# Altium schematic sheet DAPLink.SchDoc
size A4
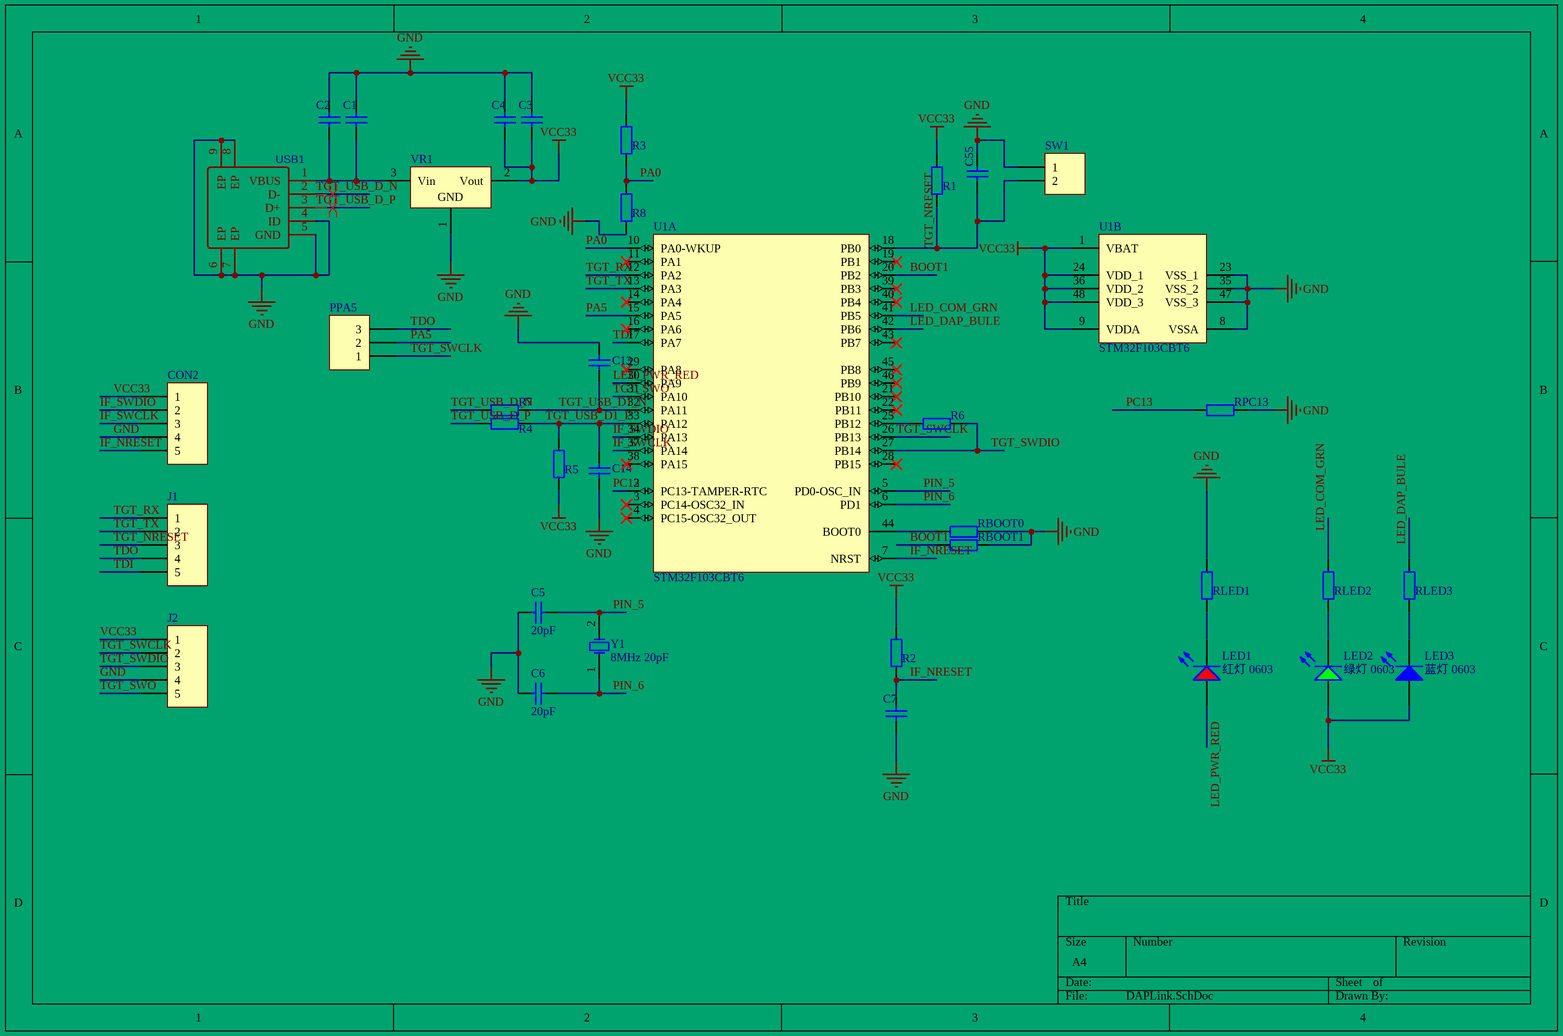
[diagram p0: DAPLink.SchDoc]

## Parts
C1  10uF (475) 10% 50V  [1206_C]  (value not drawn)
C2  100nF (475) 10% 50V  [1206_C]  (value not drawn)
C3  10uF (475) 10% 50V  [1206_C]  (value not drawn)
C4  100nF (475) 10% 50V  [1206_C]  (value not drawn)
C5  20pF  [1206_C]
C6  20pF  [1206_C]
C7  100nF (475) 10% 50V  [1206_C]  (value not drawn)
C13  18pF 10% 50V  [1206_C]  (value not drawn)
C14  18pF 10% 50V  [1206_C]  (value not drawn)
C55  100nF  10% 50V  [1206_C]  (value not drawn)
CON2  Header 5  [HDR1X5]  (value not drawn)
J1  Header 5  [HDR1X5]  (value not drawn)
J2  Header 5  [HDR1X5]  (value not drawn)
LED1  红灯 0603  [0603_LED_S1]
LED2  绿灯 0603  [0603_LED_S1]
LED3  蓝灯 0603  [0603_LED_S1]
PPA5  Header 3  [HDR1X3]  (value not drawn)
R1  100KΩ  ±1%  [1206_R]  (value not drawn)
R2  100KΩ  ±1%  [1206_R]  (value not drawn)
R3  4.7KΩ  ±1%  [1206_R]  (value not drawn)
R4  22Ω  ±1%  [1206_R]  (value not drawn)
R5  10KΩ  ±1%  [1206_R]  (value not drawn)
R6  100Ω  ±1%  [1206_R]  (value not drawn)
R7  22Ω  ±1%  [1206_R]  (value not drawn)
R8  4.7KΩ  ±1%  [1206_R]  (value not drawn)
RBOOT0  100KΩ  ±1%  [1206_R]  (value not drawn)
RBOOT1  100KΩ  ±1%  [1206_R]  (value not drawn)
RLED1  10KΩ  ±1%  [1206_R]  (value not drawn)
RLED2  10KΩ  ±1%  [1206_R]  (value not drawn)
RLED3  10KΩ  ±1%  [1206_R]  (value not drawn)
RPC13  10KΩ  ±1%  [1206_R]  (value not drawn)
SW1  Header 2  [HDR1X2]  (value not drawn)
U1  STM32F103CBT6  [LQFP-48_7x7x05P]  (parts A,B of 2)
USB1  U254-051N-4BH806  [MICRO-USB-SMD_U254-051N-4BH806]  (value not drawn)
VR1  AMS1117-3.3  [SOT-223]  (value not drawn)
Y1  8MHz 20pF  [SMD-5032_2P]

## Nets
GND: C1.2 C2.2 C3.2 C4.2 C5.1 C6.1 C7.1 C13.2 C14.1 C55.2 CON2.4 J2.4 R8.1 RBOOT0.2 RBOOT1.2 RLED1.2 RPC13.2 SW1.1 U1.8(VSSA) U1.23(VSS_1) U1.35(VSS_2) U1.47(VSS_3) USB1.4(ID) USB1.5(GND) USB1.6(EP) USB1.7(EP) USB1.8(EP) USB1.9(EP) VR1.1(GND)
VCC33: C3.1 C4.1 CON2.1 J2.1 LED2.A LED3.A R1.2 R2.2 R3.2 R5.1 U1.1(VBAT) U1.9(VDDA) U1.24(VDD_1) U1.36(VDD_2) U1.48(VDD_3) VR1.2(Vout)
BOOT1: RBOOT1.1 U1.20(PB2)
IF_NRESET: C7.2 CON2.5 R2.1 U1.7(NRST)
IF_SWCLK: CON2.3 U1.37(PA14)
IF_SWDIO: CON2.2 U1.34(PA13)
LED_COM_GRN: RLED2.2 U1.41(PB5)
LED_DAP_BULE: RLED3.2 U1.42(PB6)
LED_PWR_RED: LED1.A U1.30(PA9)
PA0: R3.1 R8.2 U1.10(PA0-WKUP)
PA5: PPA5.2 U1.15(PA5)
PC13: RPC13.1 U1.2(PC13-TAMPER-RTC)
PIN_5: C5.2 U1.5(PD0-OSC_IN) Y1.2(OSC2)
PIN_6: C6.2 U1.6(PD1) Y1.1(OSC1)
TDI: J1.5 U1.17(PA7)
TDO: J1.4 PPA5.3
TGT_NRESET: C55.1 J1.3 R1.1 SW1.2 U1.18(PB0)
TGT_RX: J1.1 U1.12(PA2)
TGT_SWCLK: J2.2 PPA5.1 U1.26(PB13)
TGT_SWDIO: J2.3 R6.2 U1.27(PB14)
TGT_SWO: J2.5 U1.31(PA10)
TGT_TX: J1.2 U1.13(PA3)
TGT_USB_D1_N: C13.1 R7.2 U1.32(PA11)
TGT_USB_D1_P: C14.2 R4.2 R5.2 U1.33(PA12)
TGT_USB_D_N: R7.1 USB1.2(D-)
TGT_USB_D_P: R4.1 USB1.3(D+)
NetC1_1: C1.1 C2.1 USB1.1(VBUS) VR1.3(Vin)
NetLED1_K: LED1.K RLED1.1
NetLED2_K: LED2.K RLED2.1
NetLED3_K: LED3.K RLED3.1
NetR6_1: R6.1 U1.25(PB12)
NetRBOOT0_1: RBOOT0.1 U1.44(BOOT0)

Not connected (* = marked no-connect by the designer): U1 3(PC14-OSC32_IN)* 4(PC15-OSC32_OUT)* 11(PA1)* 14(PA4)* 16(PA6)* 19(PB1)* 21(PB10)* 22(PB11)* 28(PB15)* 29(PA8)* 38(PA15)* 39(PB3)* 40(PB4)* 43(PB7)* 45(PB8)* 46(PB9)*

## Layout directives
differential pair: TGT_USB_D_N, TGT_USB_D_P

## Library data of the parts
C1-C4 C7 C13 C14 C55 = 1206 4.7uF (475) 10% 50V: 贴片电容; ComponentLink1Description: 供应商链接; ComponentLink1URL: http://www.szlcsc.com/product/details_30577.html; Package: 1206; Supplier: LC; SuppliersPartNumber: C29823
C5 C6 = 1206 2.2uF (225) 10% 50V: 贴片电容; ComponentLink1Description: 供应商链接; ComponentLink1URL: http://www.szlcsc.com/product/details_13292.html; Package: 1206; Supplier: LC; SuppliersPartNumber: C12656
CON2 J1 J2 = Header 5: Header, 5-Pin; LatestRevisionDate: 17-Jul-2002; LatestRevisionNote: Re-released for DXP Platform.; Publisher: Altium Limited
LED1 = 0603 红灯: 发光二极管; ComponentLink1Description: 供应商链接; ComponentLink1URL: http://www.szlcsc.com/product/details_2659.html; Package: 0603; Supplier: LC; SuppliersPartNumber: C2286
LED2 = 0603 绿灯: 发光二极管; ComponentLink1Description: 供应商链接; ComponentLink1URL: http://www.szlcsc.com/product/details_73152.html; Package: 0603; Supplier: LC; SuppliersPartNumber: C72043
LED3 = 0603 蓝灯: 发光二极管; ComponentLink1Description: 供应商链接; ComponentLink1URL: http://www.szlcsc.com/product/details_73150.html; Package: 0603; Supplier: LC; SuppliersPartNumber: C72041
PPA5 = Header 3: Header, 3-Pin; LatestRevisionDate: 17-Jul-2002; LatestRevisionNote: Re-released for DXP Platform.; Publisher: Altium Limited
R1-R8 RBOOT0 RBOOT1 RLED1-RLED3 RPC13 = 1206 0Ω (0R0) 1%: 贴片电阻; ComponentLink1Description: 供应商链接; ComponentLink1URL: http://www.szlcsc.com/product/details_18576.html; Package: 1206; Supplier: LC; SuppliersPartNumber: C17888
SW1 = Header 2: Header, 2-Pin; LatestRevisionDate: 17-Jul-2002; LatestRevisionNote: Re-released for DXP Platform.; Publisher: Altium Limited
U1 = STM32F103CBT6: ARM; ComponentLink1Description: 供应商链接; ComponentLink1URL: http://www.szlcsc.com/product/details_8796.html; Package: LQFP-48_7x7x05P; Supplier: LC; SuppliersPartNumber: C8304
USB1 = U254-051N-4BH806: microUSB; BOM_Manufacturer: XKB Enterprise; Contributor: LCSC; BOM_Supplier: LCSC; BOM_Supplier Part: C319170; BOM_Manufacturer Part: U254-051N-4BH806; spicePre: U; spiceSymbolName: U254-051N-4BH806
VR1 = SOT-223 AMS1117-3.3: 低压差线性稳压(LDO); ComponentLink1Description: 供应商链接; ComponentLink1URL: http://www.szlcsc.com/product/details_6652.html; Package: SOT-223; Supplier: LC; SuppliersPartNumber: C6186
Y1 = SMD-5032_2P 8MHz 20ppm 20pF: 贴片晶振; ComponentLink1Description: 供应商链接; ComponentLink1URL: http://www.szlcsc.com/product/details_117214.html; Package: SMD-5032_2P; Supplier: LC; SuppliersPartNumber: C115962